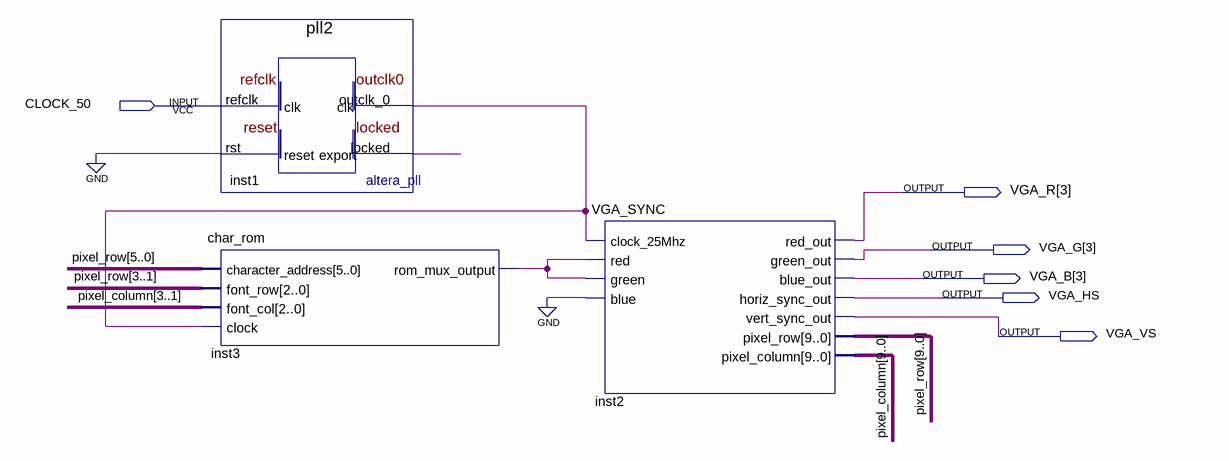
[diagram p0: schematic sheet]
// Quartus schematic char_block_diagram.bdf as structural Verilog: 3 symbols, 6 pins
module char_block_diagram (
  input  CLOCK_50,
  output [3:3] VGA_R,
  output [3:3] VGA_G,
  output [3:3] VGA_B,
  output VGA_HS,
  output VGA_VS
);

  wire inst1_locked, inst1_outclk_0, inst3_rom_mux_output;
  wire [9:0] pixel_column, pixel_row;

  pll2 inst1 (.refclk(CLOCK_50), .rst(1'b0), .outclk_0(inst1_outclk_0), .locked(inst1_locked));
  char_rom inst3 (
    .character_address(pixel_row[5:0]), .font_row(pixel_row[3:1]), .font_col(pixel_column[3:1]),
    .clock(inst1_outclk_0), .rom_mux_output(inst3_rom_mux_output));
  VGA_SYNC inst2 (
    .clock_25Mhz(inst1_outclk_0), .red(inst3_rom_mux_output), .green(inst3_rom_mux_output), .blue(1'b0),
    .red_out(VGA_R[3]), .green_out(VGA_G[3]), .blue_out(VGA_B[3]), .horiz_sync_out(VGA_HS),
    .vert_sync_out(VGA_VS), .pixel_row(pixel_row), .pixel_column(pixel_column));
endmodule
